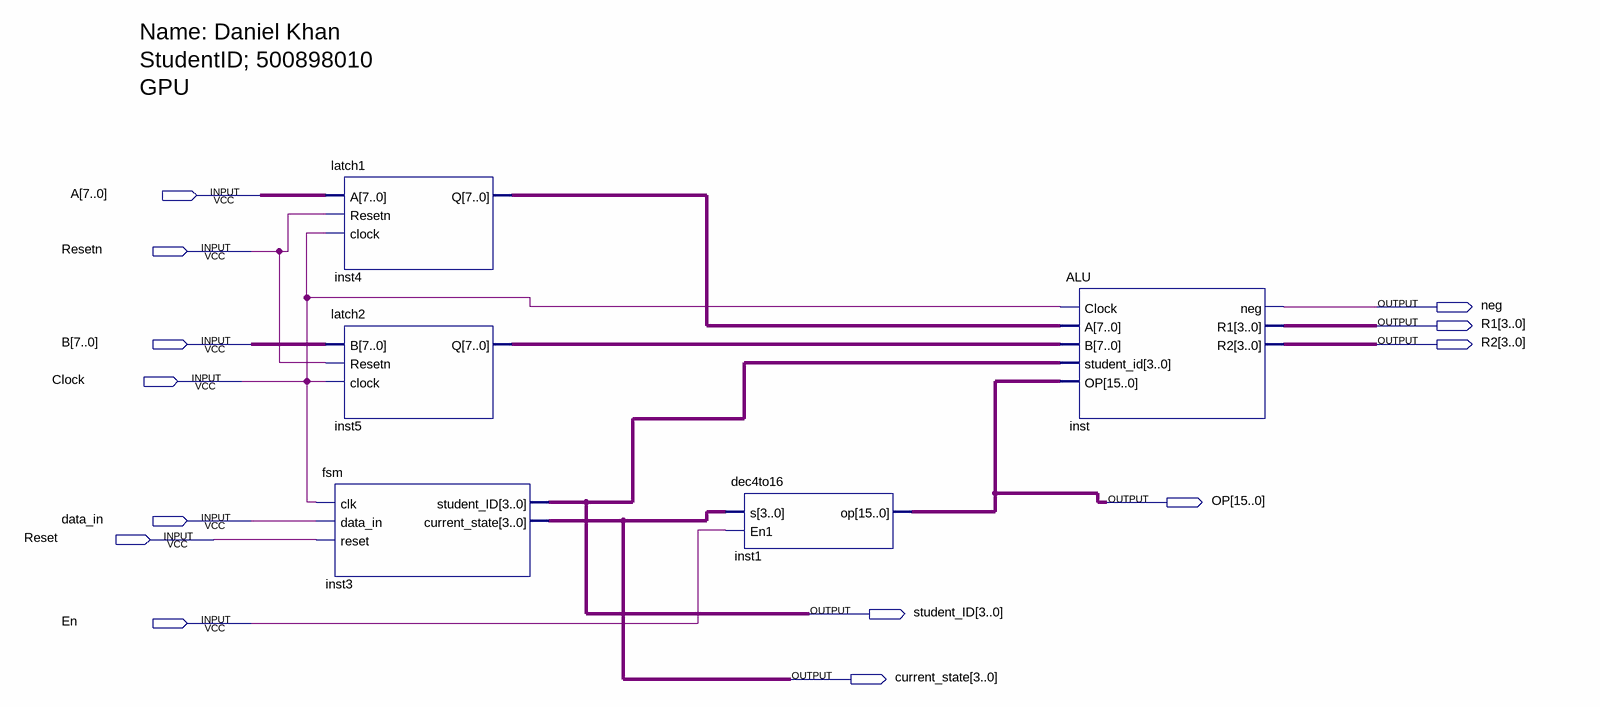
[diagram p0: schematic sheet]
// Quartus schematic gpu.bdf as structural Verilog: 5 symbols, 13 pins
module gpu (
  input  [7:0] A,
  input  Resetn,
  input  [7:0] B,
  input  Clock,
  input  data_in,
  input  Reset,
  input  En,
  output neg,
  output [3:0] R1,
  output [3:0] R2,
  output [15:0] OP,
  output [3:0] student_ID,
  output [3:0] current_state
);

  wire [7:0] inst4_q, inst5_q;

  latch1 inst4 (.A(A), .clock(Clock), .Resetn(Resetn), .Q(inst4_q));
  latch2 inst5 (.B(B), .clock(Clock), .Resetn(Resetn), .Q(inst5_q));
  fsm inst3 (.clk(Clock), .data_in(data_in), .reset(Reset), .student_ID(student_ID), .current_state(current_state));
  dec4to16 inst1 (.s(current_state), .En1(En), .op(OP));
  ALU inst (.Clock(Clock), .A(inst4_q), .B(inst5_q), .student_id(student_ID), .OP(OP), .neg(neg), .R1(R1), .R2(R2));

  // Notes on the sheet:
  //   Name: Daniel Khan
  //   StudentID; 500898010
  //   GPU
endmodule
